# EAGLE design BR85_MKL_3309_21MTC_J0_004_01_03 (EAGLE 5.10)

## Sheet 1 of 2
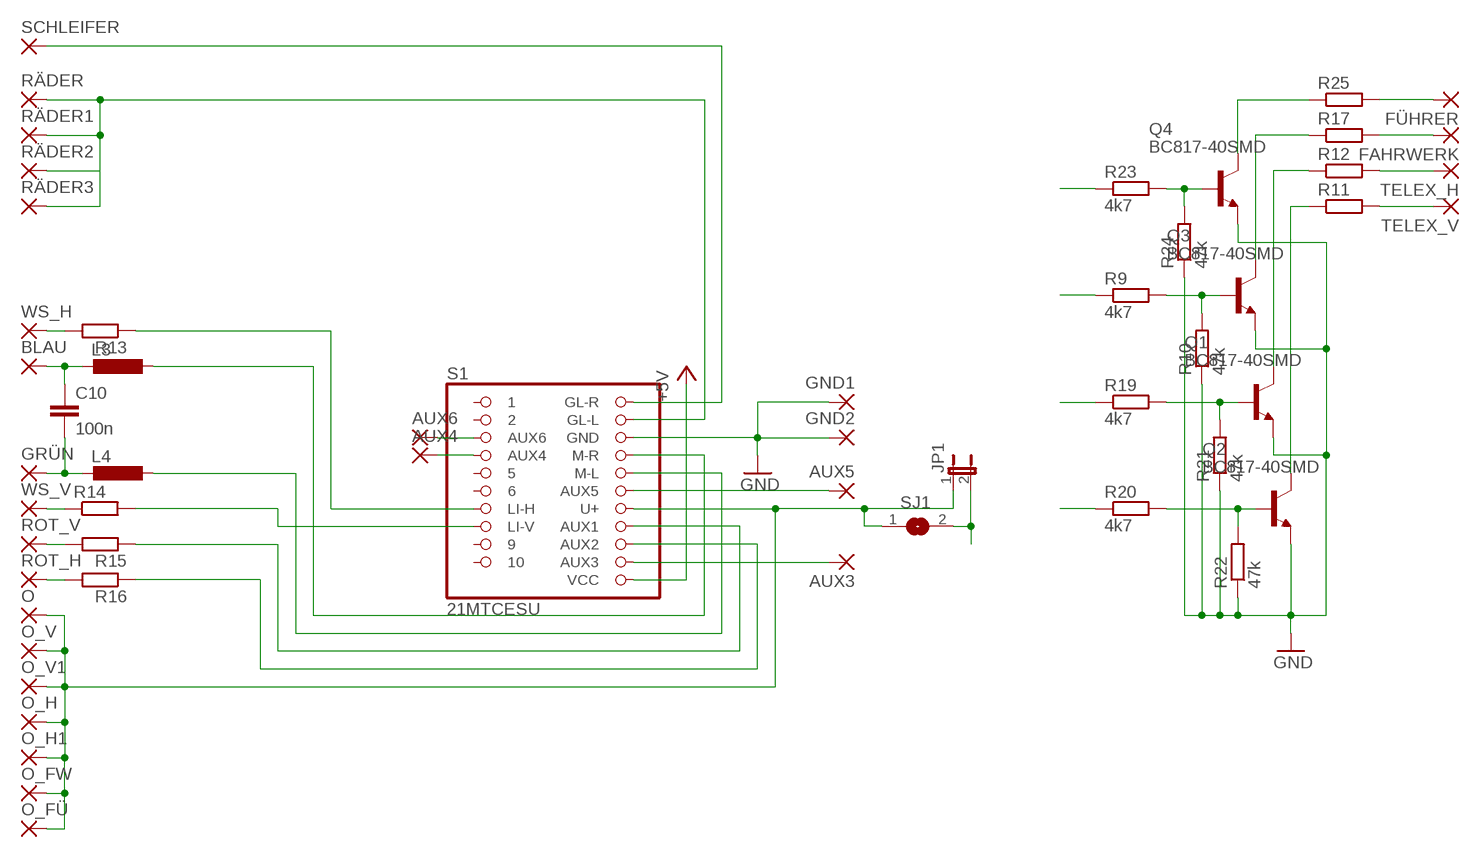
[diagram p0: schematic, sheet 1]

### Parts
AUX3  SMD2  [SMD1,27-2,54]
AUX4  SMD2  [SMD1,27-2,54]
AUX5  SMD2  [SMD1,27-2,54]
AUX6  SMD2  [SMD1,27-2,54]
BLAU  SMD2  [SMD1,27-2,54]
C10  100n  C-EUC0603  [C0603]
FAHRWERK  SMD2  [SMD1,27-2,54]
FÜHRER  SMD2  [SMD1,27-2,54]
GND1  SMD2  [SMD1,27-2,54]
GND2  SMD2  [SMD1,27-2,54]
GRÜN  SMD2  [SMD1,27-2,54]
JP1  JP1E2,00  [JP1_2]
L3  L-EUL1212  [L1212]
L4  L-EUL1212  [L1212]
O  SMD2  [SMD1,27-2,54]
O_FW  SMD2  [SMD1,27-2,54]
O_FÜ  SMD2  [SMD1,27-2,54]
O_H  SMD2  [SMD1,27-2,54]
O_H1  SMD2  [SMD1,27-2,54]
O_V  SMD2  [SMD1,27-2,54]
O_V1  SMD2  [SMD1,27-2,54]
Q1  BC817-40SMD  [SOT23-BEC]
Q2  BC817-40SMD  [SOT23-BEC]
Q3  BC817-40SMD  [SOT23-BEC]
Q4  BC817-40SMD  [SOT23-BEC]
R9  4k7  R-EU_R0603  [R0603]
R10  47k  R-EU_R0603  [R0603]
R11  R-EU_R0603S  [R0603S]
R12  R-EU_R0603S  [R0603S]
R13  R-EU_R0603S  [R0603S]
R14  R-EU_R0603S  [R0603S]
R15  R-EU_R0603S  [R0603S]
R16  R-EU_R0603S  [R0603S]
R17  R-EU_R0603S  [R0603S]
R19  4k7  R-EU_R0603  [R0603]
R20  4k7  R-EU_R0603  [R0603]
R21  47k  R-EU_R0603  [R0603]
R22  47k  R-EU_R0603  [R0603]
R23  4k7  R-EU_R0603  [R0603]
R24  47k  R-EU_R0603  [R0603]
R25  R-EU_R0603S  [R0603S]
ROT_H  SMD2  [SMD1,27-2,54]
ROT_V  SMD2  [SMD1,27-2,54]
RÄDER  SMD2  [SMD1,27-2,54]
RÄDER1  SMD2  [SMD1,27-2,54]
RÄDER2  SMD2  [SMD1,27-2,54]
RÄDER3  SMD2  [SMD1,27-2,54]
S1  21MTCESU  [21MTC_SMD_ESU]
SCHLEIFER  SMD2  [SMD1,27-2,54]
SJ1  SJ"  [SJ]
TELEX_H  SMD2  [SMD1,27-2,54]
TELEX_V  SMD2  [SMD1,27-2,54]
WS_H  SMD2  [SMD1,27-2,54]
WS_V  SMD2  [SMD1,27-2,54]

### Nets
+5V: S1.P12(VCC)
AUX1: R15.1 S1.P15(AUX1)
AUX2: R16.1 S1.P14(AUX2)
AUX3: AUX3.1(P) R9.1 S1.P13(AUX3)
AUX4: AUX4.1(P) R19.1 S1.P4(AUX4)
AUX5: AUX5.1(P) R23.1 S1.P17(AUX5)
AUX6: AUX6.1(P) R20.1 S1.P3(AUX6)
BLAU: L3.1 S1.P19(M-R)
F3: R11.2 TELEX_V.1(P)
F4: R12.2 TELEX_H.1(P)
GND: GND1.1(P) GND2.1(P) Q1.E Q2.E Q3.E Q4.E R10.1 R21.1 R22.1 R24.1 S1.P20(GND) ; also sheet 2
GRÜN: L4.1 S1.P18(M-L)
IN: JP1.2 SJ1.2 ; also sheet 2
LI-H: R13.1 S1.P7(LI-H)
LI-V: R14.2 S1.P8(LI-V)
N$1: Q3.B R9.2 R10.2
N$2: Q4.B R23.2 R24.2
N$3: R15.2 ROT_V.1(P)
N$5: Q2.C R11.1
N$6: Q1.C R12.1
N$7: Q1.B R19.2 R21.2
N$8: Q2.B R20.2 R22.2
N$9: R13.2 WS_H.1(P)
N$10: R14.1 WS_V.1(P)
N$11: R16.2 ROT_H.1(P)
N$14: C10.2 GRÜN.1(P) L4.2
N$15: BLAU.1(P) C10.1 L3.2
N$16: Q4.C R25.1
N$17: FAHRWERK.1(P) R17.2
N$18: Q3.C R17.1
N$20: FÜHRER.1(P) R25.2
ORANGE: JP1.1 O.1(P) O_FW.1(P) O_FÜ.1(P) O_H1.1(P) O_H.1(P) O_V1.1(P) O_V.1(P) S1.P16(U+) SJ1.1
RÄDER: RÄDER1.1(P) RÄDER2.1(P) RÄDER3.1(P) RÄDER.1(P) S1.P21(GL-L)
SCHLEIFER: S1.P22(GL-R) SCHLEIFER.1(P)
Unconnected: S1.P1 S1.P2 S1.P5 S1.P6 S1.P9 S1.P10

## Sheet 2 of 2
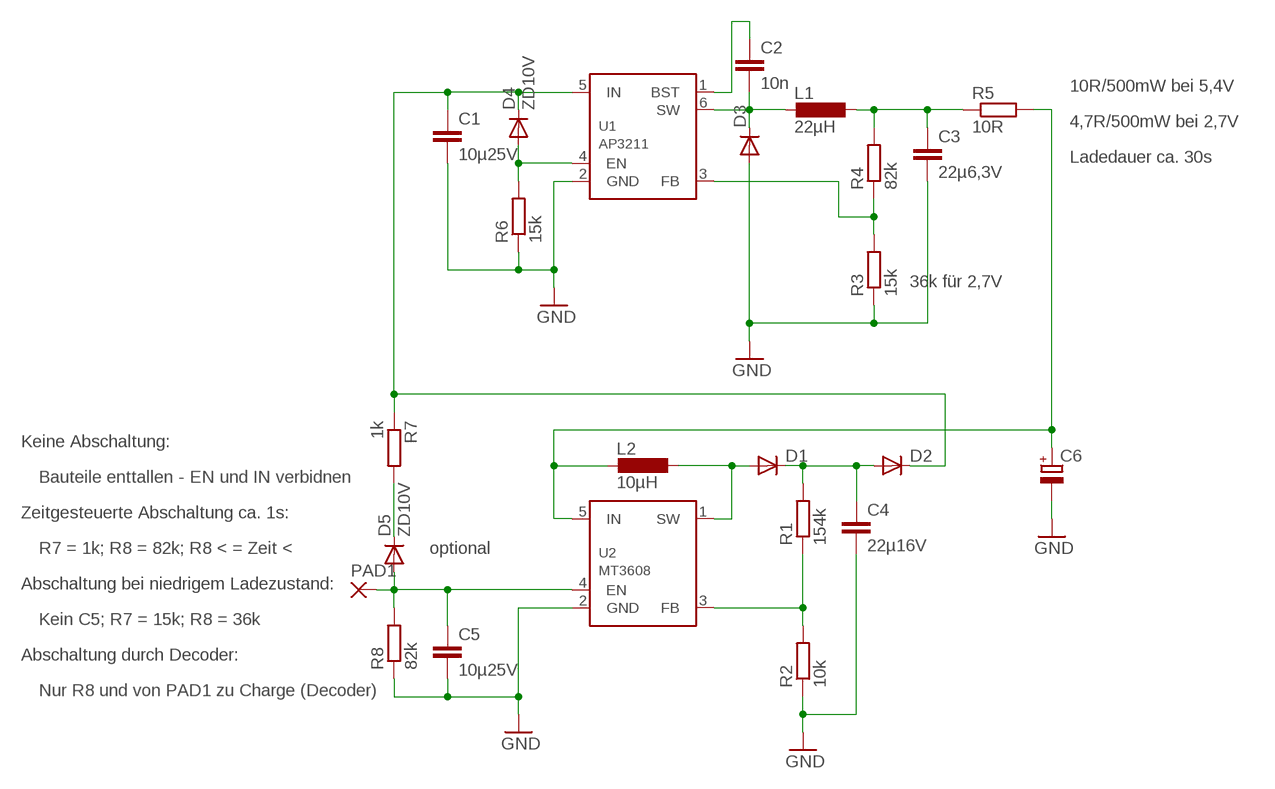
[diagram p1: schematic, sheet 2]

### Parts
C1  10µ25V  C-EUC0805  [C0805]
C2  10n  C-EUC0603  [C0603]
C3  22µ6,3V  C-EUC0805  [C0805]
C4  22µ16V  C-EUC0805  [C0805]
C5  10µ25V  C-EUC0805  [C0805]
C6  CPOL-EURECT  [RECT-13X14-9]
D1  DIODE-SOD323-R2  [SOD323-R2]
D2  DIODE-SOD323-R2  [SOD323-R2]
D3  DIODE-SOD323-R2  [SOD323-R2]
D4  ZD10V  DIODE-SOD323-R2  [SOD323-R2]
D5  ZD10V  DIODE-SOD323-R2  [SOD323-R2]
L1  22µH  L-EUL2520B  [L2520B]
L2  10µH  L-EUL4020  [L4020]
PAD1  SMD-LONG1,27-1,9  [SMD1,27-1,9]
R1  154k  R-EU_R0603  [R0603]
R2  10k  R-EU_R0603  [R0603]
R3  15k  R-EU_R0603  [R0603]
R4  82k  R-EU_R0603  [R0603]
R5  10R  R-EU_R1206  [R1206]
R6  15k  R-EU_R0603  [R0603]
R7  1k  R-EU_R0603  [R0603]
R8  82k  R-EU_R0603  [R0603]
U1  AP3211  [TSOT23-6]
U2  MT3608  [TSOT23-6]

### Nets
CAP1: C6.+ L2.2 R5.2 U2.5(IN)
GND: C1.2 C3.2 C4.2 C5.2 C6.- D3.A R2.1 R3.1 R6.1 R8.1 U1.2(GND) U2.2(GND) ; also sheet 1
IN: C1.1 D2.C D4.C R7.1 U1.5(IN) ; also sheet 1
N$13: D1.A L2.1 U2.1(SW)
N$19: C2.1 U1.1(BST)
N$25: C2.2 D3.C L1.2 U1.6(SW)
N$28: R1.1 R2.2 U2.3(FB)
N$29: C5.1 D5.A PAD1.1(P) R8.2 U2.4(EN)
N$30: C4.1 D1.C D2.A R1.2
N$31: D4.A R6.2 U1.4(EN)
N$32: D5.C R7.2
N$33: C3.1 L1.1 R4.2 R5.1
N$34: R3.2 R4.1 U1.3(FB)

### Notes on the sheet
- 10R/500mW bei 5,4V
- 4,7R/500mW bei 2,7V
- Ladedauer ca. 30s
- 36k für 2,7V
- Keine Abschaltung:
- Bauteile enttallen - EN und IN verbidnen
- Zeitgesteuerte Abschaltung ca. 1s:
- R7 = 1k; R8 = 82k; R8 < = Zeit < | optional
- Abschaltung bei niedrigem Ladezustand:
- Kein C5; R7 = 15k; R8 = 36k
- Abschaltung durch Decoder:
- Nur R8 und von PAD1 zu Charge (Decoder)

## Library data of the parts
AUX3-AUX6 BLAU FAHRWERK FÜHRER GND1 GND2 GRÜN O O_FW O_FÜ O_H O_H1 O_V O_V1 ROT_H ROT_V RÄDER RÄDER1-RÄDER3 SCHLEIFER TELEX_H TELEX_V WS_H WS_V = wirepad:SMD2: SMD PAD
C1-C5 C10 = rcl:C-EU: CAPACITOR, European symbol
C6 = rcl:CPOL-EU: POLARIZED CAPACITOR, European symbol
D1-D5 = diode:DIODE-: DIODE
JP1 = jumper:JP1E: JUMPER
L1-L4 = rcl:L-EU: INDUCTOR, European symbol
PAD1 = wirepad:SMD-LONG
Q1-Q4 = transistor-npn:BC817*: NPN Transistor
R1-R17 R19-R25 = rcl:R-EU_: RESISTOR, European symbol
S1 = pinhead:21MTC
SJ1 = jumper:SJ: SMD solder JUMPER
U1 = linear-technology:AP3211
U2 = linear-technology:MT3608

## Board
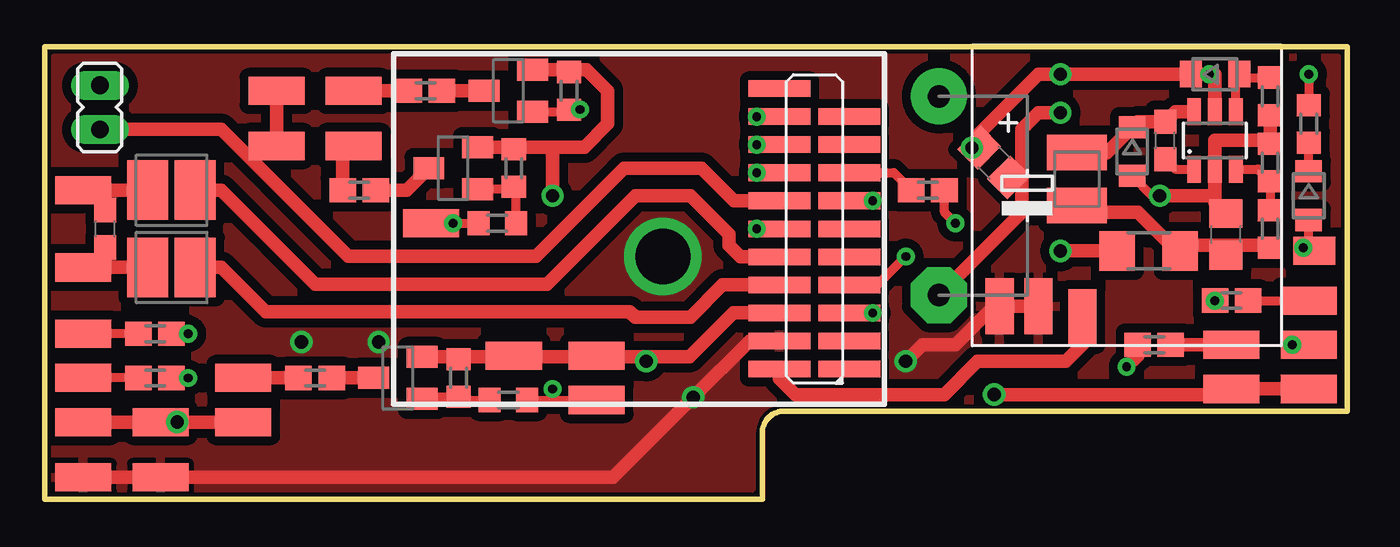
[diagram p2: board, top side]
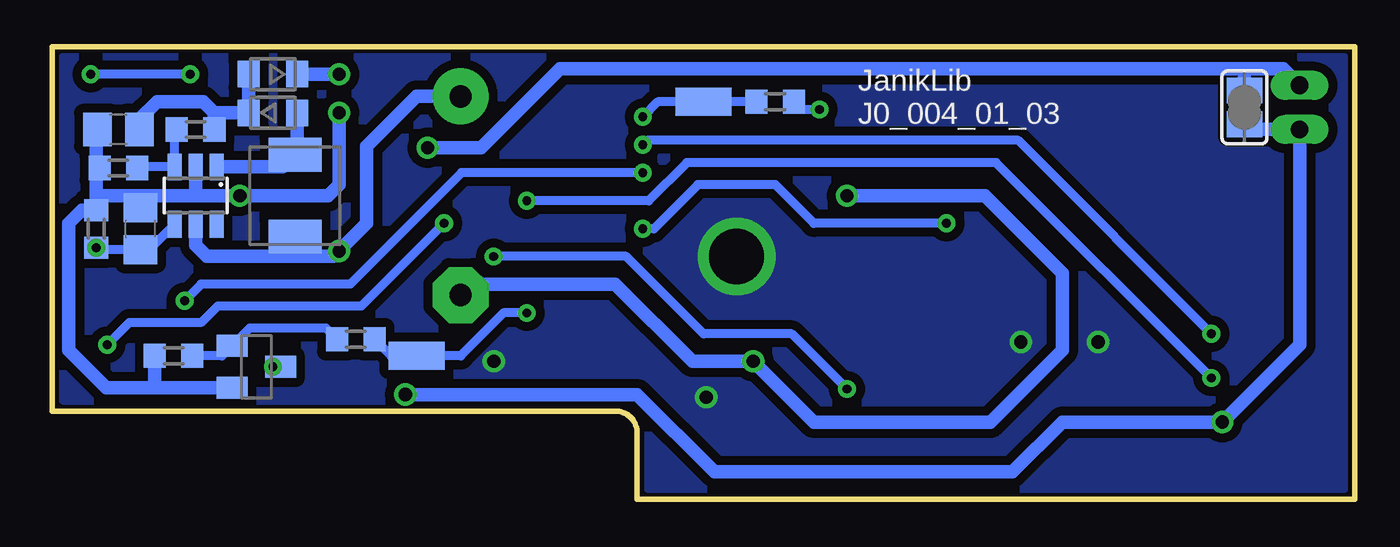
[diagram p3: board, bottom side, seen from below]

No outline drawn. Coordinates in mm, seen from the top.
Copper layers (1*16): Top 0.035mm / dielectric 1.5mm / Bottom 0.035mm
Design rules "default *": minimum track width 10mil, minimum drill 0.4mm, track to track 8mil, track to pad 8mil, pad to pad 8mil, via to via 8mil, smd to smd 8mil, copper to edge 40mil, drill to drill 8mil, minimum pad ring 10mil, minimum via ring 8mil, stop-mask expansion 4mil, vias tented up to drill 0mil, thermal gap 10mil
Milling: 7 lines

### Footprints (pad centres in the part's own frame; a part is rotated, then mirrored left to right if it is on the bottom)
SMD1,27-2,54 = smd 1.27 x 2.54: 1 0,0
C0805 = smd 1.3 x 1.5: 1 -0.95,0; 2 0.95,0
C0603 = smd 1.1 x 1: 1 -0.85,0; 2 0.85,0
RECT-13X14-9 = drill 1.016 pad 2.54 round: + -4.5,0 | drill 1.016 pad 2.54 octagon: - 4.5,0
SOD323-R2 = smd 1 x 1.2: A 1.1,0; C -1.1,0
JP1_2 = drill 0.8 long: 1 0,-1; 2 0,1
L2520B = smd 1.6 x 2.7: 1 -1.2,0; 2 1.2,0
L4020 = smd 1.55 x 2.4: 1 -1.85,0 | smd 1.5 x 2.4: 2 1.85,0
L1212 = smd 1.85 x 2.7: 1 -1.075,0; 2 1.075,0
SMD1,27-1,9 = smd 1.27 x 1.905: 1 0,0
SOT23-BEC = smd 1 x 1.4: B -0.95,-1.1; C 0,1.1; E 0.95,-1.1
R0603 = smd 1 x 1.1: 1 -0.85,0; 2 0.85,0
R1206 = smd 1.6 x 1.803: 1 -1.422,0; 2 1.422,0
R0603S = smd 1.2 x 1.1: 1 -0.75,0; 2 0.75,0
21MTC_SMD_ESU = smd 0.75 x 2.8: P1 -6.35,-0.953; P2 -5.08,-0.953; P3 -3.81,-0.953; P4 -2.54,-0.953; P5 -1.27,-0.953; P6 0,-0.953; P7 1.27,-0.953; P8 2.54,-0.953; P9 3.81,-0.953; P10 5.08,-0.953; P12 6.35,2.223; P13 5.08,2.223; P14 3.81,2.223; P15 2.54,2.223; P16 1.27,2.223; P17 0,2.223; P18 -1.27,2.223; P19 -2.54,2.223; P20 -3.81,2.223; P21 -5.08,2.223; P22 -6.35,2.223
SJ = smd 1.168 x 1.6: 1 -0.762,0; 2 0.762,0
TSOT23-6 = smd 0.62 x 1.22: 1 -0.95,-1.3; 2 0,-1.3; 3 0.95,-1.3; 4 0.95,1.3; 5 0,1.3; 6 -0.95,1.3

### Placement (x,y rotation side)
AUX3  13.5,18 90 bottom
AUX4  9,4.5 90 top
AUX5  1.5,12.5 90 top
AUX6  26.5,6.5 90 bottom
BLAU  -14.25,10.5 270 top
C1  27,15.25 315 top
C2  34.75,16.25 90 top
C3  37.5,12 90 top
C4  40,16.75 180 bottom
C5  39,12.25 90 bottom
C6  24.5,13.75 270 top
C10  -13.25,12.25 90 top
D1  33,17.5 0 bottom
D2  33,19.25 180 bottom
D3  33.25,15.75 270 top
D4  37,19.25 0 top
D5  41.25,13.75 270 top
FAHRWERK  -2,18.5 90 top
FÜHRER  -2,16 90 top
GND1  5.25,6.5 270 top
GND2  9,6.5 90 top
GRÜN  -14.25,14 270 top
JP1  -13.5,17.75 0 top
L1  30.75,14.5 90 top
L2  32,13.75 270 bottom
L3  -10.25,10.5 180 top
L4  -10.25,14 180 top
O  -10.75,3.5 270 top
O_FW  -5.5,18.5 90 top
O_FÜ  -5.5,16 90 top
O_H  -7,3.5 90 top
O_H1  -14.25,3.5 270 top
O_V  37.75,5 90 top
O_V1  41.25,5 90 top
PAD1  41.5,11.25 90 top
Q1  0,5.5 90 top
Q2  33.75,6 270 bottom
Q3  5,18.5 90 top
Q4  2.5,15 90 top
R1  36.5,16.75 0 bottom
R2  40,15 0 bottom
R3  39.5,15.25 270 top
R4  39.5,12.25 270 top
R5  34,11.25 180 top
R6  39.5,18.25 90 top
R7  41.25,17 270 top
R8  41,12.25 270 bottom
R9  10.25,18 0 bottom
R10  7.75,18.5 270 top
R11  34.25,7 0 top
R12  -3.75,5.5 180 top
R13  -11,5.5 180 top
R14  24,14 180 top
R15  37.75,9 0 top
R16  -11,7.5 180 top
R17  1.25,18.5 180 top
R19  5,4.5 180 top
R20  29.25,7.25 180 bottom
R21  2.75,5.5 270 top
R22  37.5,6.5 0 bottom
R23  4.5,12.5 0 top
R24  5.25,15 270 top
R25  -1.75,14 180 top
ROT_H  -14.25,7.5 90 top
ROT_V  41.25,9 90 top
RÄDER  29,8.75 180 top
RÄDER1  27.25,8.75 180 top
RÄDER2  -14.25,1 90 top
RÄDER3  -10.75,1 90 top
S1  19.5,12.25 90 top
SCHLEIFER  31,8.25 180 top
SJ1  -11,17.75 90 bottom
TELEX_H  -7,5.5 90 top
TELEX_V  37.75,7 90 top
U1  37,16.25 0 top
U2  36.5,13.75 180 bottom
WS_H  -14.25,5.5 90 top
WS_V  41.25,7 90 top

### Tracks (layer width: path | path; a pad name or v marks a point on that pad's centre or on a via)
AUX1  (via drill 0.4)
  Top 0.406: S1.P15 v16.25,14.79
  Bottom 0.406: R15.1 36.25,9.75 29.5,9.75 24.46,14.79 S1.P15 v16.25,14.79
  other vias: 37,9
AUX2  (via drill 0.4)
  Top 0.406: v-9.5,7.5 R16.1 | v16.25,16.06 S1.P14
  Bottom 0.406: 16.19,16 v16.25,16.06 16.06,16.25 -0.75,16.25 v-9.5,7.5
AUX3  (via drill 0.4)
  Top 0.406: v16.25,17.33 S1.P13
  Bottom 0.406: R9.1 AUX3.1 15.58,18 v16.25,17.33
AUX4  (via drill 0.4)
  Top 0.406: v23,11 21.71,9.71 S1.P4 | R19.1 7,4.5 | 7,4.5 v7,5 | 7,4.5 AUX4.1
  Bottom 0.406: v23,11 17,11 13.5,7.5 9.5,7.5 v7,5
AUX5  (via drill 0.4)
  Top 0.406: v16.25,12.25 S1.P17 | AUX5.1 v2.5,12.5 R23.1
  Bottom 0.406: v16.25,12.25 15.75,12.25 13.75,14.25 10.25,14.25 8.5,12.5 v2.5,12.5
AUX6  (via drill 0.4)
  Top 0.406: S1.P3 v21.5,8.44
  Bottom 0.406: v21.5,8.44 22.56,8.44 24.5,6.5 AUX6.1 27.65,6.5 R20.1
BLAU
  Top 0.61: S1.P19 14.71,9.71 13.25,8.25 10.75,8.25 10.5,8.5 -6,8.5 -8,10.5 L3.1
CAP1  (via drill 0.6)
  Top 0.61: v30,11.25 R5.2
  Bottom 0.61: U2.5 36.5,11.5 36,11 32,11 | 32,11 L2.2 | 32,11 30.25,11 v30,11.25 28.75,12.5 28.75,16 26.5,18.25 C6.+
F3
  Top 0.61: R11.2 TELEX_V.1
F4
  Top 0.61: TELEX_H.1 R12.2
GND  (via drill 0.6)
  Top 0.406: D3.A 34.15,13.75 v34.5,13.75
  Top 0.61: C3.2 37,13.45 U1.2 | U1.2 37,16.25 39.5,16.25 | 39.5,16.25 R6.1 | 39.5,16.25 R3.1 | U1.2 37,13.75 v34.5,13.75 | 2.75,6.45 Q1.E | S1.P20 15.19,8.44 13.2,6.45 11.25,6.45 | v30,17.5 29,17.5 28.25,16.75 28.25,14.58 | C6.- 28.25,13 28.25,14.58 | 7.75,19.45 8.55,19.45 9.5,18.5 9.5,17 8.45,15.95 7,15.95 | 5.25,15.95 Q4.E | 7.75,19.45 R10.1 | 7.75,19.45 Q3.E | v7,13.75 7,15.95 | 5.25,15.95 R24.1 | 7,15.95 5.25,15.95 | 9,6.45 GND2.1 | 11.25,6.45 9,6.45 | 5.25,6.45 GND1.1 | 9,6.45 5.25,6.45 | 28.25,14.58 C1.2 | 2.75,6.45 R21.1 | 5.25,6.45 2.75,6.45 | v11.25,6.25 11.25,6.45
  Bottom 0.61: 36.5,13.75 U2.2 | 36.5,13.75 v34.5,13.75 30.5,13.75 30,14.25 v30,17.5 | 39,13.75 41,13.75 | 41,15 41,16.75 C4.2 | 41,13.75 41,15 | 41,15 R2.1 | 39,13.75 C5.2 | 36.5,13.75 39,13.75 | 41,13.75 R8.1 41.65,13.1 42.25,12.5 42.25,6.75 40.55,5.05 38.35,5.05 | 38.35,5.05 Q2.E | 38.35,5.05 R22.1 | C6.- 24,9.75 17.5,9.75 14,6.25 v11.25,6.25 8.5,3.5 0.5,3.5 -2.75,6.75 -2.75,10.25 0.75,13.75 v7,13.75
GRÜN
  Top 0.61: L4.1 -8,14 -3.75,9.75 6.75,9.75 10.75,13.75 13.25,13.75 15,12 15,11.5 15.52,10.98 S1.P18
IN  (via drill 0.4, 0.6)
  Top 0.406: v41.25,19.25 R7.1
  Top 0.61: U1.5 37,19.25 v36.75,19.25 D4.C v30,19.25 29,19.25 26.33,16.58 C1.1 v26,15.92
  Bottom 0.406: v36.75,19.25 v41.25,19.25
  Bottom 0.61: v30,19.25 D2.C | JP1.2 -12.75,19.5 -11,19.5 | -11,19.5 20,19.5 23.58,15.92 v26,15.92 | -11,19.5 SJ1.2
LI-H  (via drill 0.4)
  Top 0.406: v-9.5,5.5 R13.1 | v21.5,13.52 S1.P7
  Bottom 0.406: v21.5,13.52 15.98,13.52 14.25,15.25 0.25,15.25 v-9.5,5.5
LI-V
  Top 0.406: S1.P8 22.46,14.79 R14.2
N$1  (via drill 0.4)
  Top 0.406: Q3.B 7.65,17.55 R10.2 v8.25,17.65
  Bottom 0.406: v8.25,17.65 9.05,17.65 R9.2
N$2
  Top 0.406: Q4.B 5.15,14.05 R24.2 5.35,14.05 R23.2
N$3
  Top 0.406: R15.2 ROT_V.1
N$5  (via drill 0.4)
  Top 0.61: v33,6 33.5,6.5 R11.1
  Bottom 0.61: Q2.C v33,6
N$6
  Top 0.61: R12.1 Q1.C
N$7
  Top 0.406: Q1.B 1.2,4.65 R21.2 2.9,4.5 R19.2
N$8
  Bottom 0.406: R20.2 30.6,7.75 34.05,7.75 Q2.B 35.3,6.5 R22.2
N$9
  Top 0.406: R13.2 WS_H.1
N$10  (via drill 0.4)
  Top 0.406: v40.5,7 WS_V.1 | v25.25,12.5 24.75,13 R14.1
  Bottom 0.406: v40.5,7 39.5,8 36.25,8 35.5,8.75 29,8.75 v25.25,12.5
N$11
  Top 0.406: R16.2 ROT_H.1
N$13
  Bottom 0.61: U2.1 32.55,15.05 L2.1 31.9,15.7 D1.A
N$14
  Top 0.61: -13.25,14 L4.2 | -13.25,14 GRÜN.1 | C10.2 -13.25,14
N$15
  Top 0.61: -13.25,10.5 BLAU.1 | -13.25,10.5 C10.1 | L3.2 -13.25,10.5
N$16
  Top 0.61: R25.1 0.4,14 Q4.C
N$17
  Top 0.61: FAHRWERK.1 R17.2
N$18
  Top 0.61: R17.1 Q3.C
N$19
  Top 0.406: U1.1 35.2,14.95 C2.1
N$20
  Top 0.61: R25.2 -2.5,15.5 FÜHRER.1
N$25
  Top 0.61: U1.6 35.2,17.55 C2.2 33.5,17.1 D3.C 32.1,15.7 L1.2
N$28
  Bottom 0.406: R1.1 37.45,16.65 U2.3 39.1,15.05 R2.2
N$29  (via drill 0.4)
  Top 0.406: D5.A 41.25,11.65 R8.2 41.15,11.25 PAD1.1
  Bottom 0.406: R8.2 40.9,11.3 C5.1 38.6,11.3 U2.4
  other vias: 41,11.4
N$30
  Bottom 0.61: D2.A D1.C 35.65,17.5 | 35.65,17.5 R1.2 | C4.1 39.05,17.2 38.25,18 36.15,18 35.65,17.5
N$31
  Top 0.406: R6.2 38.25,19.1 D4.A 37.95,19.1 U1.4
N$32
  Top 0.406: D5.C R7.2
N$33
  Top 0.61: 37.5,11.5 39.4,11.5 R4.2 | 35.42,11.5 35,11.5 33.5,13 31.05,13 L1.1 | 37.5,11.5 C3.1 | 35.42,11.5 R5.1 | 35.42,11.5 37.5,11.5
N$34
  Top 0.406: U1.3 38.95,14.95 R3.2 R4.1
ORANGE  (via drill 0.6)
  Top 0.61: O_H1.1 O.1 v-10,3.5 O_H.1 | O_V1.1 O_V.1 37,5 36.75,4.75 v27,4.75 | S1.P16 15.23,13.52 13.75,15 10.25,15 6.25,11 -2.25,11 -6.62,15.38 | JP1.1 -8,16.75 -6.62,15.38 | -6.62,15.38 -6,16 O_FÜ.1 O_FW.1
  Bottom 0.61: v27,4.75 16.5,4.75 13,1.25 -0.5,1.25 -2.75,3.5 v-10,3.5 -13.5,7 JP1.1 -11.24,16.75 SJ1.1
RÄDER  (via drill 0.6, 2.5)
  Top 0.61: S1.P21 15.92,7.17 v13.38,4.62 9.75,1 RÄDER3.1 RÄDER2.1 | RÄDER.1 RÄDER1.1 27,8.75 25.25,7 23.75,7 v23,6.25
  other vias: 12,11 -0.88,7.12 -4.38,7.12
  pour Top (isolate 0.406, rank 2): -15.5,20 42.5,20 42.5,4.5 17.5,4.5 arc90 16,3 16,0.5 -15.5,0.5
  pour Bottom (isolate 0.406, rank 2): -15.5,20 42.5,20 42.5,4.5 17.5,4.5 arc90 16,3 16,0.5 -15.5,0.5
SCHLEIFER
  Top 0.61: S1.P22 17.28,5.47 18,4.75 24.75,4.75 26.25,6.25 30.25,6.25 31,7 SCHLEIFER.1

### Text on the board
bNames: JanikLib | J0_004_01_03
tStop: BR85 21MTC für Märklin 3309 | design by Janik Merz
bStop: design by Janik Merz